# Altium schematic sheet PWR.SchDoc
size Tabloid; SheetNumber: 2; SheetTotal: 3; Sheet_Name: Insert name in Document Parameters; Size: 11x17
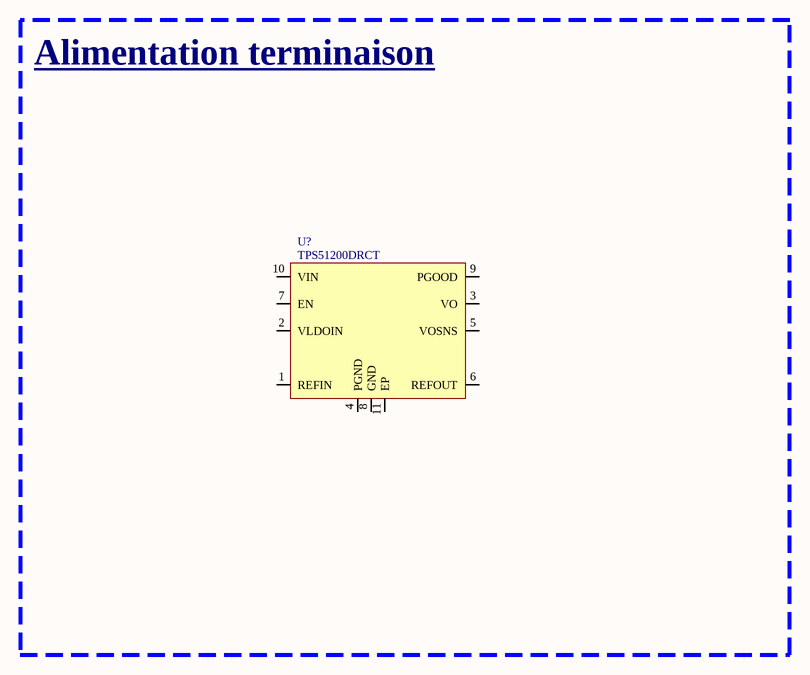
[diagram p0: PWR.SchDoc]

## Parts
U?  TPS51200DRCT  [REG_PMIC_TPS51200DRCT]

## Blocks framed on the sheet
Alimentation terminaison: U?

## Nets

Not connected (* = marked no-connect by the designer): U? 1(REFIN) 2(VLDOIN) 3(VO) 4(PGND) 5(VOSNS) 6(REFOUT) 7(EN) 8(GND) 9(PGOOD) 10(VIN) 11(EP)

## Notes on the sheet
- Sheet Name
- Project Title
- Global Project
- Size
- Group
- Revision
- Date
- Sheet
- of
- Filename
- Designers

## Library data of the parts
U? = REG_PMIC_TPS51200DRCT: REG - DDR TERMINATION/REF REG - 10-VFDFN; Manufacturer #1: Texas Instruments; Value: DDR, DDR2, DDR3(L), DDR4; Voltage Rating: 2.375V ~ 3.5V; Current Rating: Source: 3A~4.5A, Sink: 3.5A~5.5A; GRAMS Lib Spec: 2.8; Magnetic Material: Unknown; Polarized: Yes; Tolerance: *; Power Max: *; HelpURL: http://www.ti.com/lit/ds/symlink/tps51200.pdf; CreatedBy/Date: Joel Lemay 2019-03-19; VerifiedBy: Nicolas V. (2019-05-31); Temperature: -40°C ~ 85°C; Package: 10-VFDFN; Manufacturer #2: *; Note: *; Assembly Type: SMD; Part Number #2: *; Part Number #1: TPS51200DRCT; Supplier 1: Digi-Key; Supplier Part Number 1: 296-23830-1-ND; Cryo: UNKNOWN